# Altium schematic sheet controller.SchDoc
size 297 x 209 mm; SheetNumber: 1; SheetTotal: 2
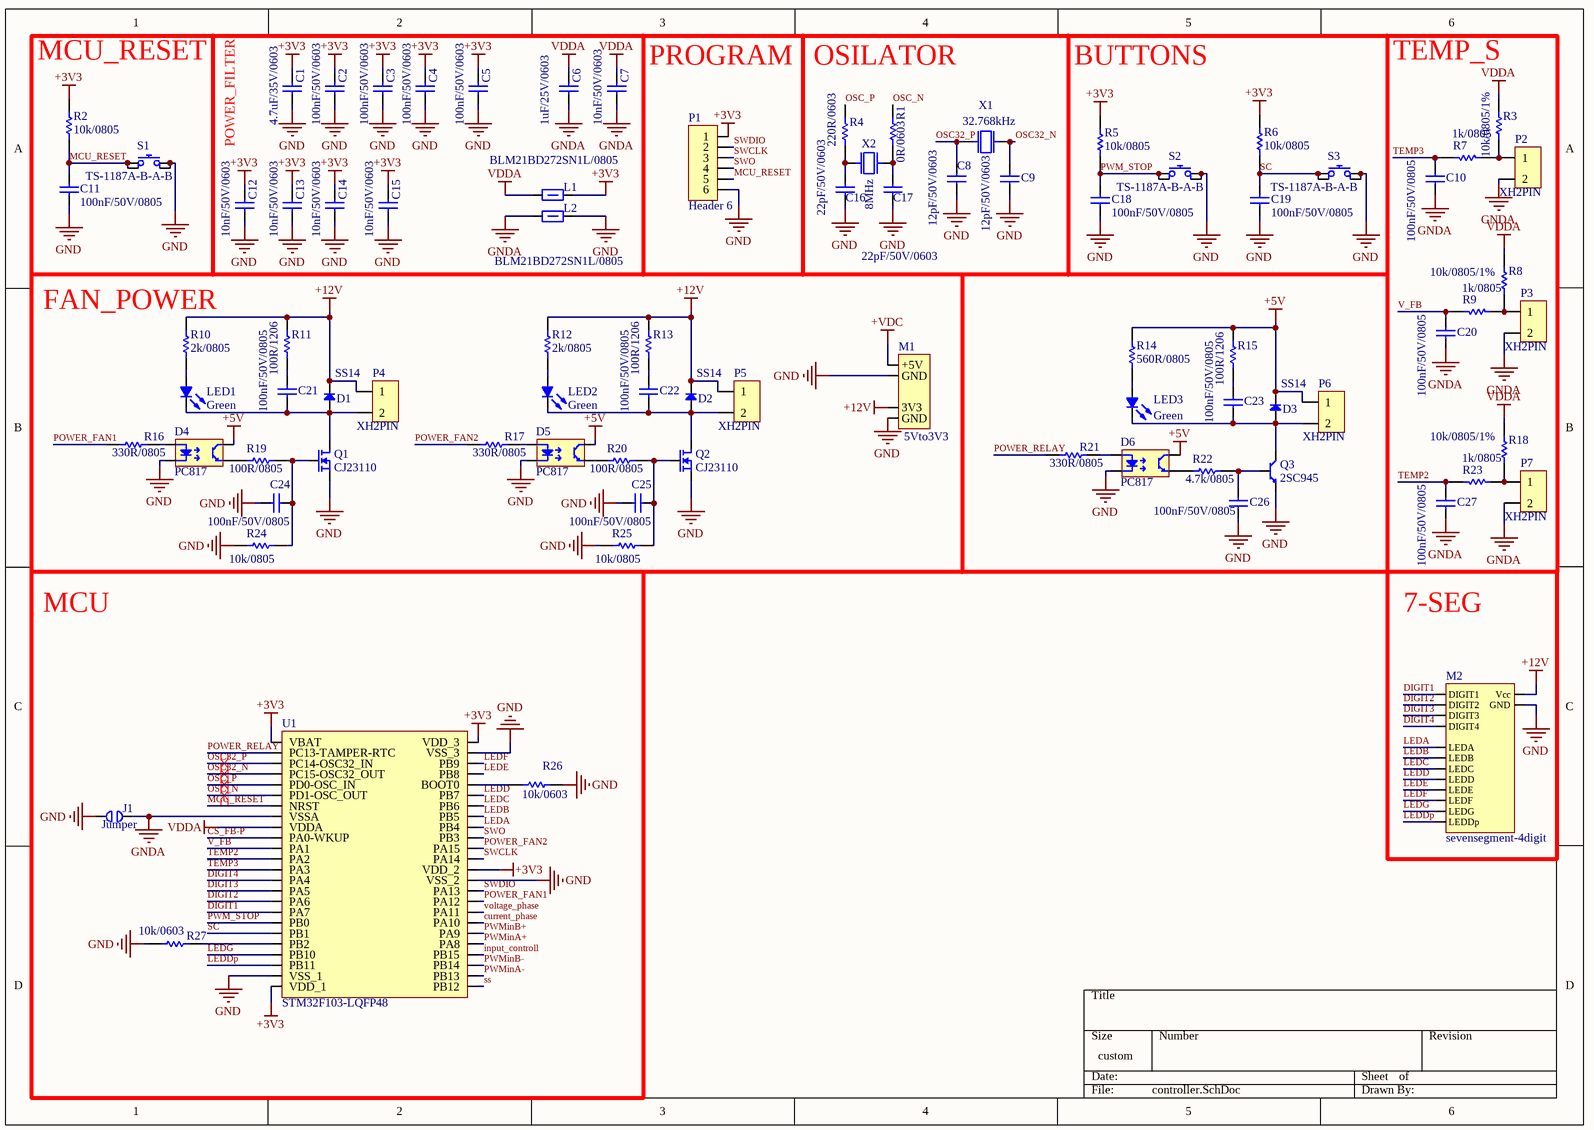
[diagram p0: controller.SchDoc]

## Parts
C1  4.7uF/35V/0603  [cap 0603]
C2  100nF/50V/0603  [cap 0603]
C3  100nF/50V/0603  [cap 0603]
C4  100nF/50V/0603  [cap 0603]
C5  100nF/50V/0603  [cap 0603]
C6  1uF/25V/0603  [cap 0603]
C7  10nF/50V/0603  [cap 0603]
C8  12pF/50V/0603  [cap 0603]
C9  12pF/50V/0603  [cap 0603]
C10  100nF/50V/0805  [CAP 0805]
C11  100nF/50V/0805  [CAP 0805]
C12  10nF/50V/0603  [cap 0603]
C13  10nF/50V/0603  [cap 0603]
C14  10nF/50V/0603  [cap 0603]
C15  10nF/50V/0603  [cap 0603]
C16  22pF/50V/0603  [cap 0603]
C17  22pF/50V/0603  [cap 0603]
C18  100nF/50V/0805  [CAP 0805]
C19  100nF/50V/0805  [CAP 0805]
C20  100nF/50V/0805  [CAP 0805]
C21  100nF/50V/0805  [CAP 0805]
C22  100nF/50V/0805  [CAP 0805]
C23  100nF/50V/0805  [CAP 0805]
C24  100nF/50V/0805  [CAP 0805]
C25  100nF/50V/0805  [CAP 0805]
C26  100nF/50V/0805  [CAP 0805]
C27  100nF/50V/0805  [CAP 0805]
D1  SS14  [SMA]
D2  SS14  [SMA]
D3  SS14  [SMA]
D4  PC817  [pc817]
D5  PC817  [pc817]
D6  PC817  [pc817]
J1  Jumper  [pin-header 2*1]
L1  BLM21BD272SN1L/0805  [RES 0805]
L2  BLM21BD272SN1L/0805  [RES 0805]
LED1  COLOR: Green  [LED 3mm]  (hidden comment: LED 3mm/Green)
LED2  COLOR: Green  [LED 3mm]  (hidden comment: LED 3mm/Green)
LED3  COLOR: Green  [LED 3mm]  (hidden comment: LED 3mm/Green)
M1  5Vto3V3  [5Vto3V3]
M2  sevensegment-4digit  [7-SEG-BOARD]
P1  Header 6  [pin-header 6*1]
P2  XH2PIN  [XH-2Pin]
P3  XH2PIN  [XH-2Pin]
P4  XH2PIN  [XH-2Pin]
P5  XH2PIN  [XH-2Pin]
P6  XH2PIN  [pin-header 2*1]
P7  XH2PIN  [XH-2Pin]
Q1  CJ23110  [SOT-23]
Q2  CJ23110  [SOT-23]
Q3  2SC945  [SOT-23]
R1  0R/0603  [Resistor 0603]
R2  10k/0805  [RES 0805]
R3  10k/0805/1%  [RES 0805]
R4  220R/0603  [Resistor 0603]
R5  10k/0805  [RES 0805]
R6  10k/0805  [RES 0805]
R7  1k/0805  [RES 0805]
R8  10k/0805/1%  [RES 0805]
R9  1k/0805  [RES 0805]
R10  2k/0805  [RES 0805]
R11  100R/1206  [RES 1206]
R12  2k/0805  [RES 0805]
R13  100R/1206  [RES 1206]
R14  560R/0805  [RES 0805]
R15  100R/1206  [RES 1206]
R16  330R/0805  [RES 0805]
R17  330R/0805  [RES 0805]
R18  10k/0805/1%  [RES 0805]
R19  100R/0805  [RES 0805]
R20  100R/0805  [RES 0805]
R21  330R/0805  [RES 0805]
R22  4.7k/0805  [RES 0805]
R23  1k/0805  [RES 0805]
R24  10k/0805  [RES 0805]
R25  10k/0805  [RES 0805]
R26  10k/0603  [Resistor 0603]
R27  10k/0603  [Resistor 0603]
S1  TS-1187A-B-A-B  [TS-1187A-B-A-B(push button)]
S2  TS-1187A-B-A-B  [TS-1187A-B-A-B(push button)]
S3  TS-1187A-B-A-B  [TS-1187A-B-A-B(push button)]
U1  STM32F103-LQFP48  [LQFP48]
X1  32.768kHz  [CRYSTAL(32.768)-SMD]
X2  8MHz  [crystal(8M)-smd]

## Blocks framed on the sheet
MCU_RESET: C11 R2 S1

## Nets
+3V3: C1.1(+) C2.2(-) C3.2(-) C4.1(+) C5.2(-) C12.2(-) C13.2(-) C14.1(+) C15.2(-) L1.2 P1.1 R2.1 R5.1 R6.1 U1.1(VBAT) U1.24(VDD_1) U1.36(VDD_2) U1.48(VDD_3)
+5V: D3.2 D4.4(Collector) D5.4(Collector) D6.4(Collector) P6.1 R14.2 R15.1
+12V: D1.2 D2.2 M1.3(3V3) M2.13(Vcc) P4.1 P5.1 R10.2 R11.1 R12.2 R13.1
+VDC: M1.1(+5V)
GND: C1.2(-) C2.1(+) C3.1(+) C4.2(-) C5.1(+) C8.1(+) C9.1(+) C11.1(+) C12.1(+) C13.1(+) C14.2(-) C15.1(+) C16.1(+) C17.1(+) C18.1(+) C19.1(+) C24.1(+) C25.1(+) C26.1(+) D4.2(Cathode) D5.2(Cathode) D6.2(Cathode) J1.1 L2.2 M1.2(GND) M1.4(GND) M2.14(GND) P1.6 Q1.2(S) Q2.2(S) Q3.2(E) R24.2 R25.2 R26.2 R27.2 S1.2 S1.3 S2.2 S2.3 S3.2 S3.3 U1.23(VSS_1) U1.35(VSS_2) U1.47(VSS_3)
GNDA: C6.1(+) C7.2(-) C10.2(-) C20.2(-) C27.2(-) J1.2 L2.1 P2.2 P3.2 P7.2 U1.8(VSSA)
VDDA: C6.2(-) C7.1(+) L1.1 R3.1 R8.1 R18.1 U1.9(VDDA)
CS_FB-P: U1.10(PA0-WKUP)
current_phase: U1.31(PA10)
DIGIT1: M2.1(DIGIT1) U1.17(PA7)
DIGIT2: M2.2(DIGIT2) U1.16(PA6)
DIGIT3: M2.3(DIGIT3) U1.15(PA5)
DIGIT4: M2.4(DIGIT4) U1.14(PA4)
input_controll: U1.28(PB15)
LEDA: M2.5(LEDA) U1.40(PB4)
LEDB: M2.6(LEDB) U1.41(PB5)
LEDC: M2.7(LEDC) U1.42(PB6)
LEDD: M2.8(LEDD) U1.43(PB7)
LEDDp: M2.12(LEDDp) U1.22(PB11)
LEDE: M2.9(LEDE) U1.45(PB8)
LEDF: M2.10(LEDF) U1.46(PB9)
LEDG: M2.11(LEDG) U1.21(PB10)
MCU_RESET: C11.2(-) P1.5 R2.2 S1.1 S1.4 U1.7(NRST)
OSC32_N: C9.2(-) U1.4(PC15-OSC32_OUT) X1.2
OSC32_P: C8.2(-) U1.3(PC14-OSC32_IN) X1.1
OSC_N: R1.1 U1.6(PD1-OSC_OUT)
OSC_P: R4.1 U1.5(PD0-OSC_IN)
POWER_FAN1: R16.2 U1.33(PA12)
POWER_FAN2: R17.2 U1.38(PA15)
POWER_RELAY: R21.2 U1.2(PC13-TAMPER-RTC)
PWM_STOP: C18.2(-) R5.2 S2.1 S2.4 U1.18(PB0)
PWMinA+: U1.29(PA8)
PWMinA-: U1.26(PB13)
PWMinB+: U1.30(PA9)
PWMinB-: U1.27(PB14)
SC: C19.2(-) R6.2 S3.1 S3.4 U1.19(PB1)
ss: U1.25(PB12)
SWCLK: P1.3 U1.37(PA14)
SWDIO: P1.2 U1.34(PA13)
SWO: P1.4 U1.39(PB3)
TEMP2: C27.1(+) R23.2 U1.12(PA2)
TEMP3: C10.1(+) R7.2 U1.13(PA3)
V_FB: C20.1(+) R9.2 U1.11(PA1)
voltage_phase: U1.32(PA11)
NetC16_2: C16.2(-) R4.2 X2.1
NetC17_2: C17.2(-) R1.2 X2.2
NetC21_1: C21.1(+) D1.1 LED1.2(K) P4.2 Q1.3(D)
NetC21_2: C21.2(-) R11.2
NetC22_1: C22.1(+) D2.1 LED2.2(K) P5.2 Q2.3(D)
NetC22_2: C22.2(-) R13.2
NetC23_1: C23.1(+) D3.1 LED3.2(K) P6.2 Q3.3(C)
NetC23_2: C23.2(-) R15.2
NetC24_2: C24.2(-) Q1.1(G) R19.1 R24.1
NetC25_2: C25.2(-) Q2.1(G) R20.1 R25.1
NetC26_2: C26.2(-) Q3.1(B) R22.1
NetD4_1: D4.1(Anode) R16.1
NetD4_3: D4.3(Emitter) R19.2
NetD5_1: D5.1(Anode) R17.1
NetD5_3: D5.3(Emitter) R20.2
NetD6_1: D6.1(Anode) R21.1
NetD6_3: D6.3(Emitter) R22.2
NetLED1_1: LED1.1(A) R10.1
NetLED2_1: LED2.1(A) R12.1
NetLED3_1: LED3.1(A) R14.1
NetP2_1: P2.1 R3.2 R7.1
NetP3_1: P3.1 R8.2 R9.1
NetP7_1: P7.1 R18.2 R23.1
NetR26_1: R26.1 U1.44(BOOT0)
NetR27_1: R27.1 U1.20(PB2)

## Layout directives
differential pair: OSC32_N, OSC32_P, OSC_N, OSC_P

## Notes on the sheet
- (near C7) PROGRAM
- OSILATOR
- BUTTONS
- (near R3) TEMP_S
- POWER_FILTER
- (near R10) FAN_POWER
- MCU
- 7-SEG

## Library data of the parts
C1-C27 = Capacitor
D1-D3 = Diode
L1 L2 = Ferrite Bead
LED1-LED3 = LED: Typical LED
P2-P7 = Header 2H: RELAY; LatestRevisionDate: 17-Jul-2002; LatestRevisionNote: Re-released for DXP Platform.; Publisher: Altium Limited
Q1 Q2 = Mosfet N-channel
Q3 = BJT-NPN
R1-R6 R8 R11 R13 R15-R22 R24-R27 = Res 0.5 W
  R1: value: 0R/0603
  R2 R5 R6 R24 R25: value: 10k/0805
  R3 R8 R18: value: 10k/0805/1%
  R4: value: 220R/0603
  R11 R13 R15: value: 100R/1206
  R16 R17 R21: value: 330R/0805
  R19 R20: value: 100R/0805
  R22: value: 4.7k/0805
  R26 R27: value: 10k/0603
R7 R9 R23 = Res1: Resistor; Published: 8-Jun-2000; LatestRevisionDate: 17-Jul-2002; LatestRevisionNote: Re-released for DXP Platform.; PackageReference: AXIAL-0.3; Publisher: Altium Limited; PackageDescription: Axial Device, Thru-Hole; 2 Leads; 0.3 in Pin Spacing; Value: 1k/0805
R10 R12 R14 = Res
  R10 R12: value: 2k/0805
  R14: value: 560R/0805
S1-S3 = push button
U1 = STM32F103C8T6
X1 X2 = crystal